# Altium schematic sheet INDICATOR.SchDoc
size A4
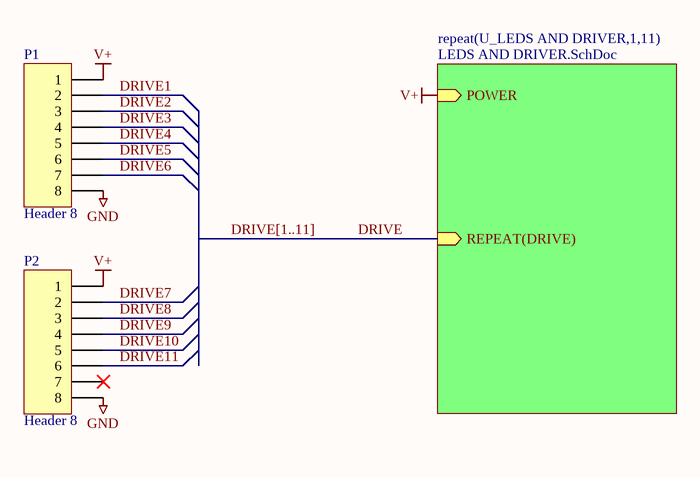
[diagram p0: INDICATOR.SchDoc]

## Parts
P1  Header 8  [HDR1X8]
P2  Header 8  [HDR1X8]

## Sub-sheets
repeat(U_LEDS AND DRIVER,1,11) = LEDS AND DRIVER.SchDoc: POWER (in), REPEAT(DRIVE) (in)

## Nets
GND: P1.8 P2.8
V+: P1.1 P2.1 ; sheet repeat(U_LEDS AND DRIVER,1,11)/POWER
DRIVE: sheet repeat(U_LEDS AND DRIVER,1,11)/REPEAT(DRIVE)
DRIVE1: P1.2
DRIVE2: P1.3
DRIVE3: P1.4
DRIVE4: P1.5
DRIVE5: P1.6
DRIVE6: P1.7
DRIVE7: P2.2
DRIVE8: P2.3
DRIVE9: P2.4
DRIVE10: P2.5
DRIVE11: P2.6

Not connected (* = marked no-connect by the designer): P2 7*

## Buses and harness runs
bus DRIVE[1..11]

## Library data of the parts
P1 P2 = Header 8: Header, 8-Pin; LatestRevisionDate: 17-Jul-2002; LatestRevisionNote: Re-released for DXP Platform.; Publisher: Altium Limited